# EAGLE design Proto-Pi-B+ (EAGLE 6.3)
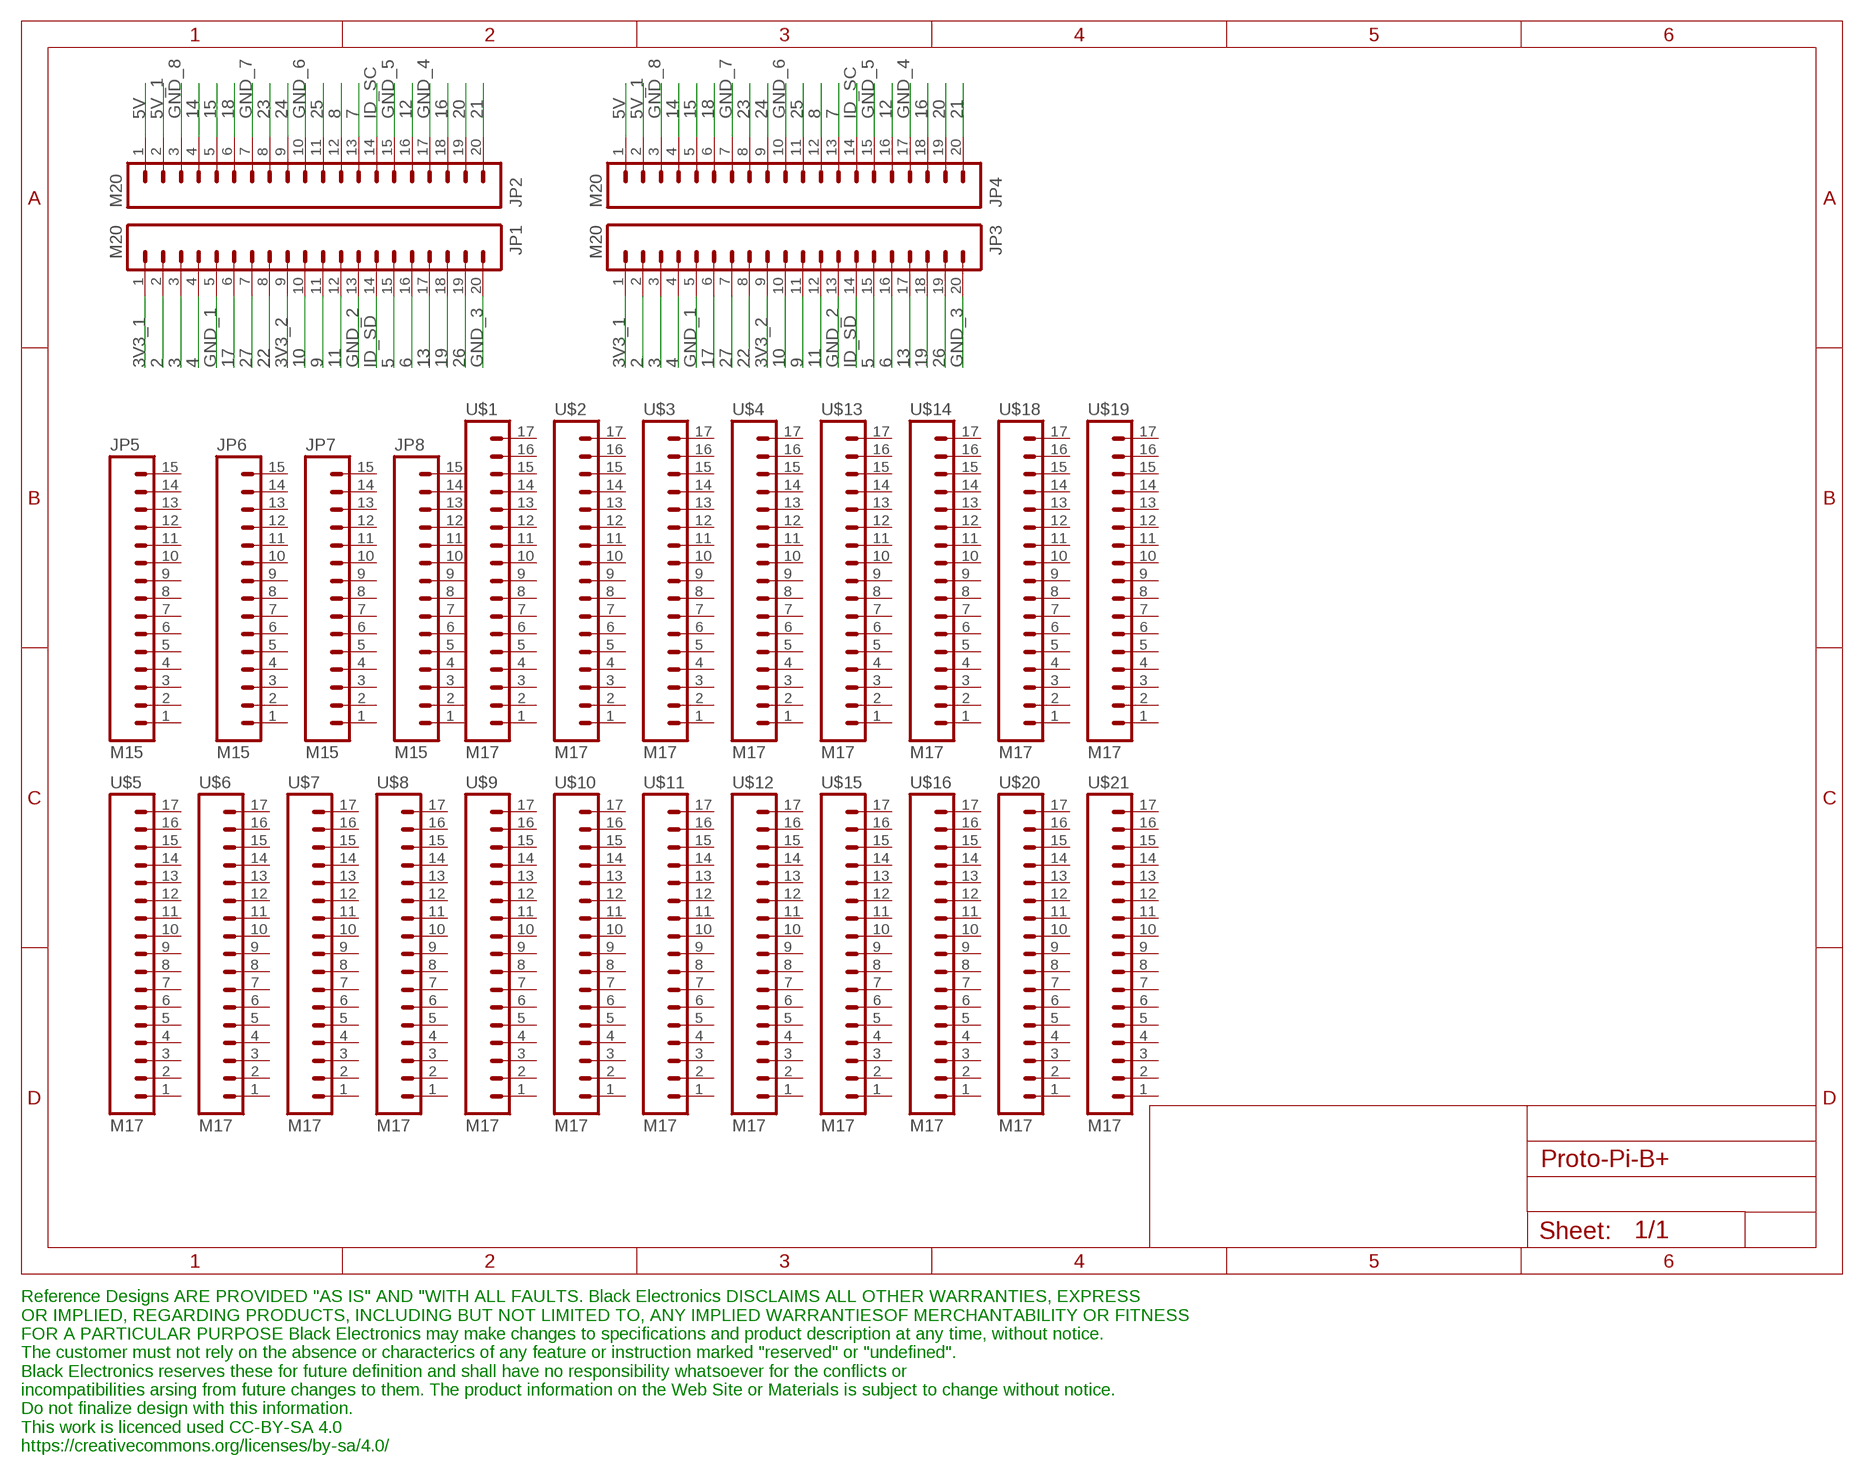
[diagram p0: schematic, sheet 1]

## Parts
JP1  M20  [1X20]
JP2  M20  [1X20]
JP3  M20  [1X20]
JP4  M20  [1X20]
JP5  M15  [1X15]
JP6  M15  [1X15]
JP7  M15  [1X15]
JP8  M15  [1X15]
U$1  M17  [1X17]
U$2  M17  [1X17]
U$3  M17  [1X17]
U$4  M17  [1X17]
U$5  M17  [1X17]
U$6  M17  [1X17]
U$7  M17  [1X17]
U$8  M17  [1X17]
U$9  M17  [1X17]
U$10  M17  [1X17]
U$11  M17  [1X17]
U$12  M17  [1X17]
U$13  M17  [1X17]
U$14  M17  [1X17]
U$15  M17  [1X17]
U$16  M17  [1X17]
U$18  M17  [1X17]
U$19  M17  [1X17]
U$20  M17  [1X17]
U$21  M17  [1X17]

## Nets
2: JP1.2 JP3.2
3: JP1.3 JP3.3
3V3_1: JP1.1 JP3.1
3V3_2: JP1.9 JP3.9
4: JP1.4 JP3.4
5: JP1.15 JP3.15
5V: JP2.1 JP4.1
5V_1: JP2.2 JP4.2
6: JP1.16 JP3.16
7: JP2.13 JP4.13
8: JP2.12 JP4.12
9: JP1.11 JP3.11
10: JP1.10 JP3.10
11: JP1.12 JP3.12
12: JP2.16 JP4.16
13: JP1.17 JP3.17
14: JP2.4 JP4.4
15: JP2.5 JP4.5
16: JP2.18 JP4.18
17: JP1.6 JP3.6
18: JP2.6 JP4.6
19: JP1.18 JP3.18
20: JP2.19 JP4.19
21: JP2.20 JP4.20
22: JP1.8 JP3.8
23: JP2.8 JP4.8
24: JP2.9 JP4.9
25: JP2.11 JP4.11
26: JP1.19 JP3.19
27: JP1.7 JP3.7
GND_1: JP1.5 JP3.5
GND_2: JP1.13 JP3.13
GND_3: JP1.20 JP3.20
GND_4: JP2.17 JP4.17
GND_5: JP2.15 JP4.15
GND_6: JP2.10 JP4.10
GND_7: JP2.7 JP4.7
GND_8: JP2.3 JP4.3
ID_SC: JP2.14 JP4.14
ID_SD: JP1.14 JP3.14
Unconnected: JP5.1 JP5.2 JP5.3 JP5.4 JP5.5 JP5.6 JP5.7 JP5.8 JP5.9 JP5.10 JP5.11 JP5.12 JP5.13 JP5.14 JP5.15 JP6.1 JP6.2 JP6.3 JP6.4 JP6.5 JP6.6 JP6.7 JP6.8 JP6.9 JP6.10 JP6.11 JP6.12 JP6.13 JP6.14 JP6.15 JP7.1 JP7.2 JP7.3 JP7.4 JP7.5 JP7.6 JP7.7 JP7.8 JP7.9 JP7.10 JP7.11 JP7.12 JP7.13 JP7.14 JP7.15 JP8.1 JP8.2 JP8.3 JP8.4 JP8.5 JP8.6 JP8.7 JP8.8 JP8.9 JP8.10 JP8.11 JP8.12 JP8.13 JP8.14 JP8.15 U$1.1 U$1.2 U$1.3 U$1.4 U$1.5 U$1.6 U$1.7 U$1.8 U$1.9 U$1.10 U$1.11 U$1.12 U$1.13 U$1.14 U$1.15 U$1.16 U$1.17 U$2.1 U$2.2 U$2.3 U$2.4 U$2.5 U$2.6 U$2.7 U$2.8 U$2.9 U$2.10 U$2.11 U$2.12 U$2.13 U$2.14 U$2.15 U$2.16 U$2.17 U$3.1 U$3.2 U$3.3 U$3.4 U$3.5 U$3.6 U$3.7 U$3.8 U$3.9 U$3.10 U$3.11 U$3.12 U$3.13 U$3.14 U$3.15 U$3.16 U$3.17 U$4.1 U$4.2 U$4.3 U$4.4 U$4.5 U$4.6 U$4.7 U$4.8 U$4.9 U$4.10 U$4.11 U$4.12 U$4.13 U$4.14 U$4.15 U$4.16 U$4.17 U$5.1 U$5.2 U$5.3 U$5.4 U$5.5 U$5.6 U$5.7 U$5.8 U$5.9 U$5.10 U$5.11 U$5.12 U$5.13 U$5.14 U$5.15 U$5.16 U$5.17 U$6.1 U$6.2 U$6.3 U$6.4 U$6.5 U$6.6 U$6.7 U$6.8 U$6.9 U$6.10 U$6.11 U$6.12 U$6.13 U$6.14 U$6.15 U$6.16 U$6.17 U$7.1 U$7.2 U$7.3 U$7.4 U$7.5 U$7.6 U$7.7 U$7.8 U$7.9 U$7.10 U$7.11 U$7.12 U$7.13 U$7.14 U$7.15 U$7.16 U$7.17 U$8.1 U$8.2 U$8.3 U$8.4 U$8.5 U$8.6 U$8.7 U$8.8 U$8.9 U$8.10 U$8.11 U$8.12 U$8.13 U$8.14 U$8.15 U$8.16 U$8.17 U$9.1 U$9.2 U$9.3 U$9.4 U$9.5 U$9.6 U$9.7 U$9.8 U$9.9 U$9.10 U$9.11 U$9.12 U$9.13 U$9.14 U$9.15 U$9.16 U$9.17 U$10.1 U$10.2 U$10.3 U$10.4 U$10.5 U$10.6 U$10.7 U$10.8 U$10.9 U$10.10 U$10.11 U$10.12 U$10.13 U$10.14 U$10.15 U$10.16 U$10.17 U$11.1 U$11.2 U$11.3 U$11.4 U$11.5 U$11.6 U$11.7 U$11.8 U$11.9 U$11.10 U$11.11 U$11.12 U$11.13 U$11.14 U$11.15 U$11.16 U$11.17 U$12.1 U$12.2 U$12.3 U$12.4 U$12.5 U$12.6 U$12.7 U$12.8 U$12.9 U$12.10 U$12.11 U$12.12 U$12.13 U$12.14 U$12.15 U$12.16 U$12.17 U$13.1 U$13.2 U$13.3 U$13.4 U$13.5 U$13.6 U$13.7 U$13.8 U$13.9 U$13.10 U$13.11 U$13.12 U$13.13 U$13.14 U$13.15 U$13.16 U$13.17 U$14.1 U$14.2 U$14.3 U$14.4 U$14.5 U$14.6 U$14.7 U$14.8 U$14.9 U$14.10 U$14.11 U$14.12 U$14.13 U$14.14 U$14.15 U$14.16 U$14.17 U$15.1 U$15.2 U$15.3 U$15.4 U$15.5 U$15.6 U$15.7 U$15.8 U$15.9 U$15.10 U$15.11 U$15.12 U$15.13 U$15.14 U$15.15 U$15.16 U$15.17 U$16.1 U$16.2 U$16.3 U$16.4 U$16.5 U$16.6 U$16.7 U$16.8 U$16.9 U$16.10 U$16.11 U$16.12 U$16.13 U$16.14 U$16.15 U$16.16 U$16.17 U$18.1 U$18.2 U$18.3 U$18.4 U$18.5 U$18.6 U$18.7 U$18.8 U$18.9 U$18.10 U$18.11 U$18.12 U$18.13 U$18.14 U$18.15 U$18.16 U$18.17 U$19.1 U$19.2 U$19.3 U$19.4 U$19.5 U$19.6 U$19.7 U$19.8 U$19.9 U$19.10 U$19.11 U$19.12 U$19.13 U$19.14 U$19.15 U$19.16 U$19.17 U$20.1 U$20.2 U$20.3 U$20.4 U$20.5 U$20.6 U$20.7 U$20.8 U$20.9 U$20.10 U$20.11 U$20.12 U$20.13 U$20.14 U$20.15 U$20.16 U$20.17 U$21.1 U$21.2 U$21.3 U$21.4 U$21.5 U$21.6 U$21.7 U$21.8 U$21.9 U$21.10 U$21.11 U$21.12 U$21.13 U$21.14 U$21.15 U$21.16 U$21.17

## Notes on the sheet
- Reference Designs ARE PROVIDED "AS IS" AND "WITH ALL FAULTS. Black Electronics DISCLAIMS ALL OTHER WARRANTIES, EXPRESS 
  OR IMPLIED, REGARDING PRODUCTS, INCLUDING BUT NOT LIMITED TO, ANY IMPLIED WARRANTIESOF MERCHANTABILITY OR FITNESS
  FOR A PARTICULAR PURPOSE Black Electronics may make changes to specifications and product description at any time, without notice.
  The customer must not rely on the absence or characterics of any feature or instruction marked "reserved" or "undefined".
  Black Electronics reserves these for future definition and shall have no responsibility whatsoever for the conflicts or 
  incompatibilities arsing from future changes to them. The product information on the Web Site or Materials is subject to change without notice.
  Do not finalize design with this information.
  This work is licenced used CC-BY-SA 4.0
  https://creativecommons.org/licenses/by-sa/4.0/

## Library data of the parts
JP1-JP4 = SparkFun:M20: This is just like the LOCK variant in that the holes are staggared by 5 mil, but except for the last two holes. They are not altered from the "standard" footprint layout. This is used for a special purpose on the layout of our Graphic LCD Backpack. Make sure you want to use this device before selecting it for you project!
JP5-JP8 = SparkFun-Connectors:M15: Header 15 Standard 15-pin 0.1" header. Use with straight break away headers (SKU : PRT-00116), right angle break away headers (PRT-00553), swiss pins (PRT-00743), machine pins (PRT-00117), and female headers (PRT-00115).
U$1-U$16 U$18-U$21 = SparkFun:M17

## Board
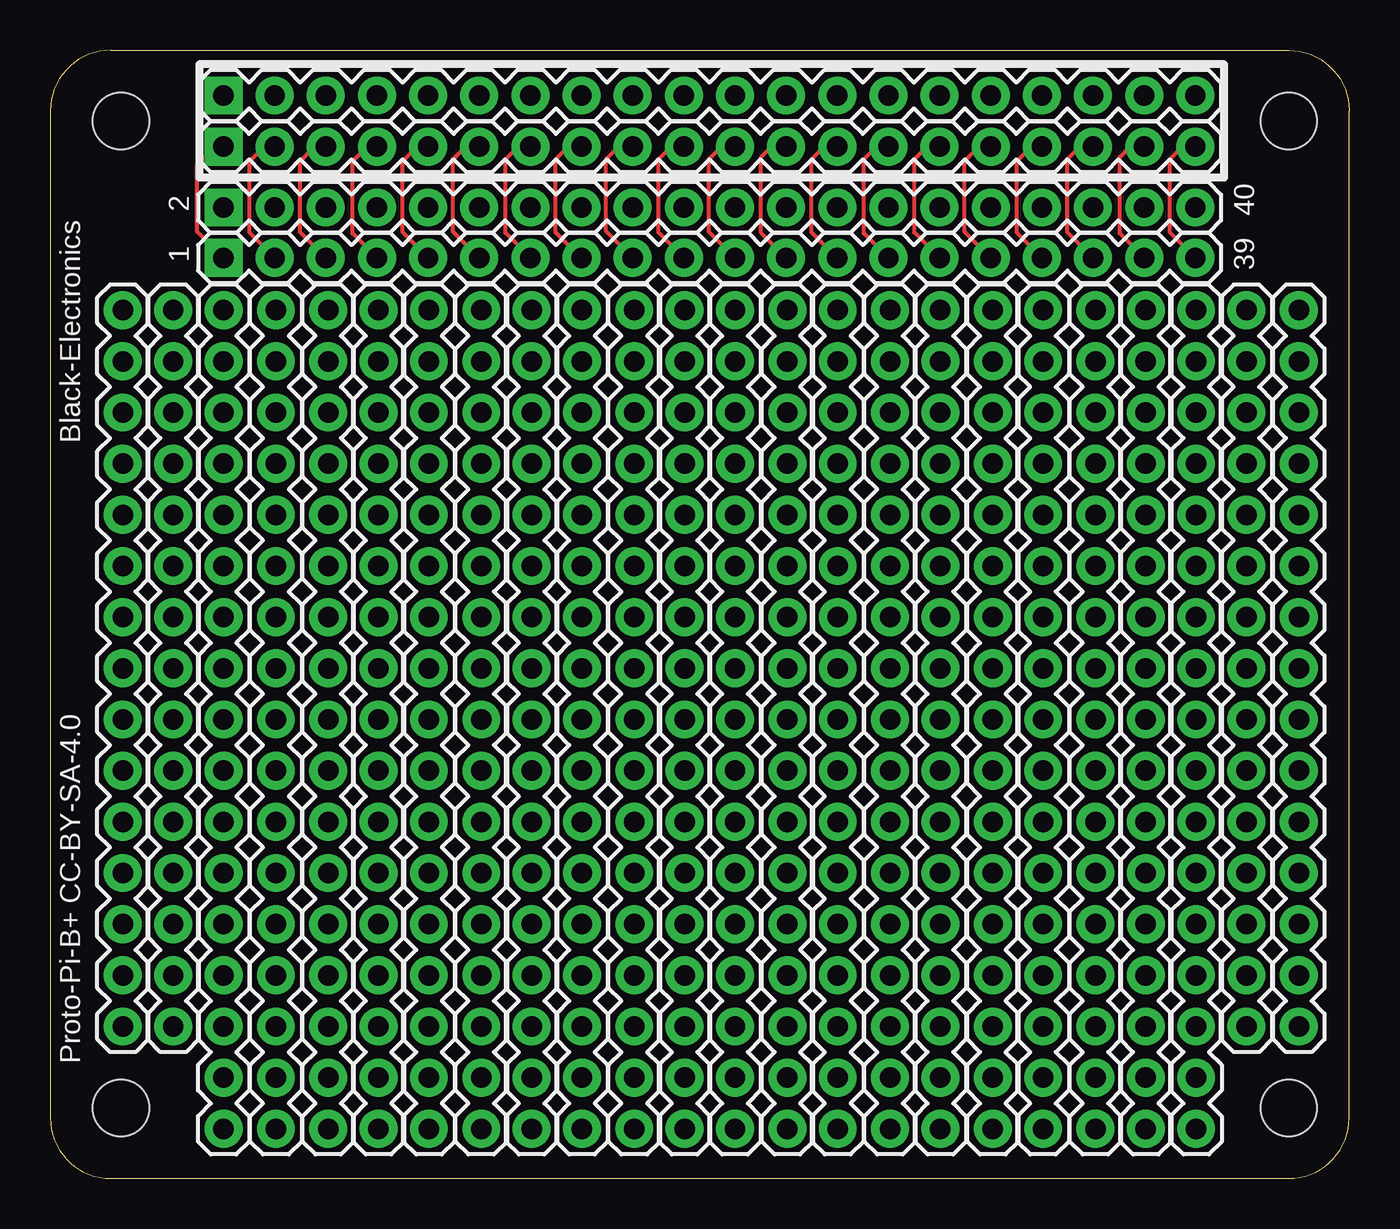
[diagram p1: board, top side]
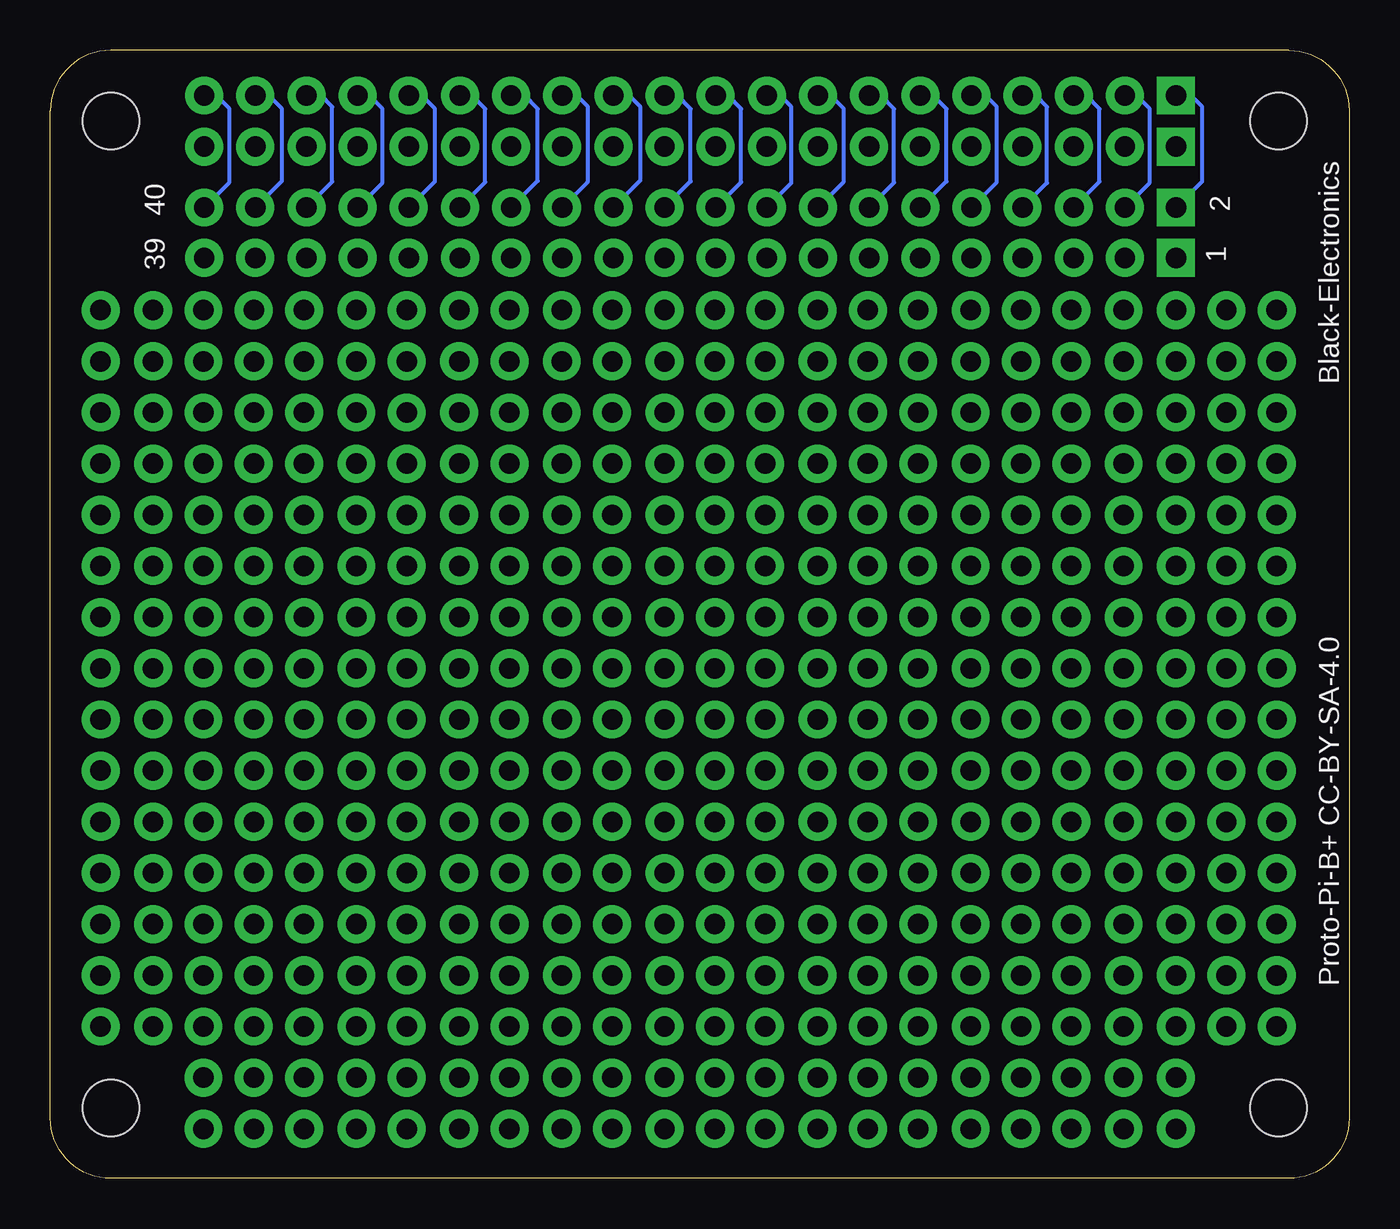
[diagram p2: board, bottom side, seen from below]

Size 64.5 x 56 mm. Coordinates in mm from the lower left corner, seen from the top.
Outline: 3,56 61.5,56 arc-90 64.5,53 64.5,3 arc-90 61.5,0 3,0 arc-90 0,3 0,53 arc-90 3,56
Copper layers (1*16): Top 0.035mm / dielectric 1.5mm / Bottom 0.035mm
Design rules "Fusion_eagle_rule_v1.1": minimum track width 6mil, minimum drill 12mil, track to track 6mil, track to pad 6mil, pad to pad 6mil, via to via 6mil, smd to smd 0mil, copper to edge 10mil, drill to drill 10mil, minimum pad ring 10mil, minimum via ring 6mil, stop-mask expansion 2mil, vias tented up to drill 100mil, thermal gap 10mil
Holes 2.8 mm at 3.5,52.5 61.5,52.5 3.5,3.5 61.5,3.5

### Footprints (pad centres in the part's own frame; a part is rotated, then mirrored left to right if it is on the bottom)
1X20 = drill 1.016 pad 1.88 square: 1 0,0 | drill 1.016 pad 1.88: 2 2.54,0; 3 5.08,0; 4 7.62,0; 5 10.16,0; 6 12.7,0; 7 15.24,0; 8 17.78,0; 9 20.32,0; 10 22.86,0; 11 25.4,0; 12 27.94,0; 13 30.48,0; 14 33.02,0; 15 35.56,0; 16 38.1,0; 17 40.64,0; 18 43.18,0; 19 45.72,0; 20 48.26,0
1X15 = drill 1.016 pad 1.88: 1 0,0; 2 2.54,0; 3 5.08,0; 4 7.62,0; 5 10.16,0; 6 12.7,0; 7 15.24,0; 8 17.78,0; 9 20.32,0; 10 22.86,0; 11 25.4,0; 12 27.94,0; 13 30.48,0; 14 33.02,0; 15 35.56,0
1X17 = drill 1.016 pad 1.88: 1 0,0; 2 2.54,0; 3 5.08,0; 4 7.62,0; 5 10.16,0; 6 12.7,0; 7 15.24,0; 8 17.78,0; 9 20.32,0; 10 22.86,0; 11 25.4,0; 12 27.94,0; 13 30.48,0; 14 33.02,0; 15 35.56,0; 16 38.1,0; 17 40.64,0

### Placement (x,y rotation side)
JP1  8.6,51.22 0 top
JP2  8.6,53.76 0 top
JP3  8.6,45.7 0 top
JP4  8.6,48.2 0 top
JP5  6.1,43.1 270 top
JP6  3.6,43.1 270 top
JP7  59.4,43.1 270 top
JP8  62,43.1 270 top
U$1  8.6,43.1 270 top
U$2  11.2,43.1 270 top
U$3  13.8,43.1 270 top
U$4  16.3,43.1 270 top
U$5  18.8,43.1 270 top
U$6  21.4,43.1 270 top
U$7  23.9,43.1 270 top
U$8  26.4,43.1 270 top
U$9  29,43.1 270 top
U$10  31.5,43.1 270 top
U$11  34,43.1 270 top
U$12  36.6,43.1 270 top
U$13  39.1,43.1 270 top
U$14  41.7,43.1 270 top
U$15  44.2,43.1 270 top
U$16  46.8,43.1 270 top
U$18  49.3,43.1 270 top
U$19  51.9,43.1 270 top
U$20  54.4,43.1 270 top
U$21  56.9,43.1 270 top

### Tracks (layer width: path | path; a pad name or v marks a point on that pad's centre or on a via)
2
  Top 0.2: JP3.2 9.9,46.94 9.9,50.5 10.62,51.22 JP1.2
3
  Top 0.2: JP3.3 12.4,46.98 12.4,50.5 13.12,51.22 JP1.3
3V3_1
  Top 0.2: JP3.1 7.3,47 7.3,50.3 8.22,51.22 JP1.1
3V3_2
  Top 0.2: JP3.9 27.6,47.02 27.6,50.6 28.22,51.22 JP1.9
4
  Top 0.2: JP3.4 15,46.92 15,50.5 15.72,51.22 JP1.4
5
  Top 0.2: JP3.15 42.9,46.96 42.9,50.6 43.52,51.22 JP1.15
5V
  Bottom 0.2: JP4.1 7.3,49.5 7.3,53.2 7.86,53.76 JP2.1
5V_1
  Bottom 0.2: JP4.2 9.9,49.44 9.9,53.1 10.56,53.76 JP2.2
6
  Top 0.2: JP3.16 45.4,47 45.4,50.5 46.12,51.22 JP1.16
7
  Bottom 0.2: JP4.13 37.8,49.48 37.8,53.2 38.36,53.76 JP2.13
8
  Bottom 0.2: JP4.12 35.2,49.54 35.2,53.2 35.76,53.76 JP2.12
9
  Top 0.2: JP3.11 32.7,47 32.7,50.6 33.32,51.22 JP1.11
10
  Top 0.2: JP3.10 30.2,46.96 30.2,50.6 30.82,51.22 JP1.10
11
  Top 0.2: JP3.12 35.3,46.94 35.3,50.7 35.82,51.22 JP1.12
12
  Bottom 0.2: JP4.16 45.4,49.5 45.4,53.1 46.06,53.76 JP2.16
13
  Top 0.2: JP3.17 48,46.94 48,50.5 48.72,51.22 JP1.17
14
  Bottom 0.2: JP4.4 15,49.42 15,53.2 15.56,53.76 JP2.4
15
  Bottom 0.2: JP4.5 17.5,49.46 17.5,53.2 18.06,53.76 JP2.5
16
  Bottom 0.2: JP4.18 50.5,49.48 50.5,53.2 51.06,53.76 JP2.18
17
  Top 0.2: JP3.6 20,47 20,50.6 20.62,51.22 JP1.6
18
  Bottom 0.2: JP4.6 20,49.5 20,53.1 20.66,53.76 JP2.6
19
  Top 0.2: JP3.18 50.5,46.98 50.5,50.6 51.12,51.22 JP1.18
20
  Bottom 0.2: JP4.19 53,49.52 53,53.1 53.66,53.76 JP2.19
21
  Bottom 0.2: JP4.20 55.6,49.46 55.6,53.1 56.26,53.76 JP2.20
22
  Top 0.2: JP3.8 25.1,46.98 25.1,50.6 25.72,51.22 JP1.8
23
  Bottom 0.2: JP4.8 25.1,49.48 25.1,53.1 25.76,53.76 JP2.8
24
  Bottom 0.2: JP4.9 27.7,49.42 27.7,53.2 28.26,53.76 JP2.9
25
  Bottom 0.2: JP4.11 32.7,49.5 32.7,53.1 33.36,53.76 JP2.11
26
  Top 0.2: JP3.19 53.1,46.92 53.1,50.7 53.62,51.22 JP1.19
27
  Top 0.2: JP3.7 22.6,46.94 22.6,50.6 23.22,51.22 JP1.7
GND_1
  Top 0.2: JP3.5 17.5,46.96 17.5,50.5 18.22,51.22 JP1.5
GND_2
  Top 0.2: JP3.13 37.8,46.98 37.8,50.6 38.42,51.22 JP1.13
GND_3
  Top 0.2: JP3.20 55.6,46.96 55.6,50.6 56.22,51.22 JP1.20
GND_4
  Bottom 0.2: JP4.17 48,49.44 48,53.1 48.66,53.76 JP2.17
GND_5
  Bottom 0.2: JP4.15 42.9,49.46 42.9,53.1 43.56,53.76 JP2.15
GND_6
  Bottom 0.2: JP4.10 30.2,49.46 30.2,53.1 30.86,53.76 JP2.10
GND_7
  Bottom 0.2: JP4.7 22.6,49.44 22.6,53.1 23.26,53.76 JP2.7
GND_8
  Bottom 0.2: JP4.3 12.4,49.48 12.4,53.1 13.06,53.76 JP2.3
ID_SC
  Bottom 0.2: JP4.14 40.3,49.52 40.3,53.1 40.96,53.76 JP2.14
ID_SD
  Top 0.2: JP3.14 40.4,46.92 40.4,50.6 41.02,51.22 JP1.14

### Text on the board
tPlace: 2 | 40 | 1 | 39 | Black-Electronics | Proto-Pi-B+ CC-BY-SA-4.0
bPlace: Black-Electronics | 2 | 40 | 1 | 39 | Proto-Pi-B+ CC-BY-SA-4.0